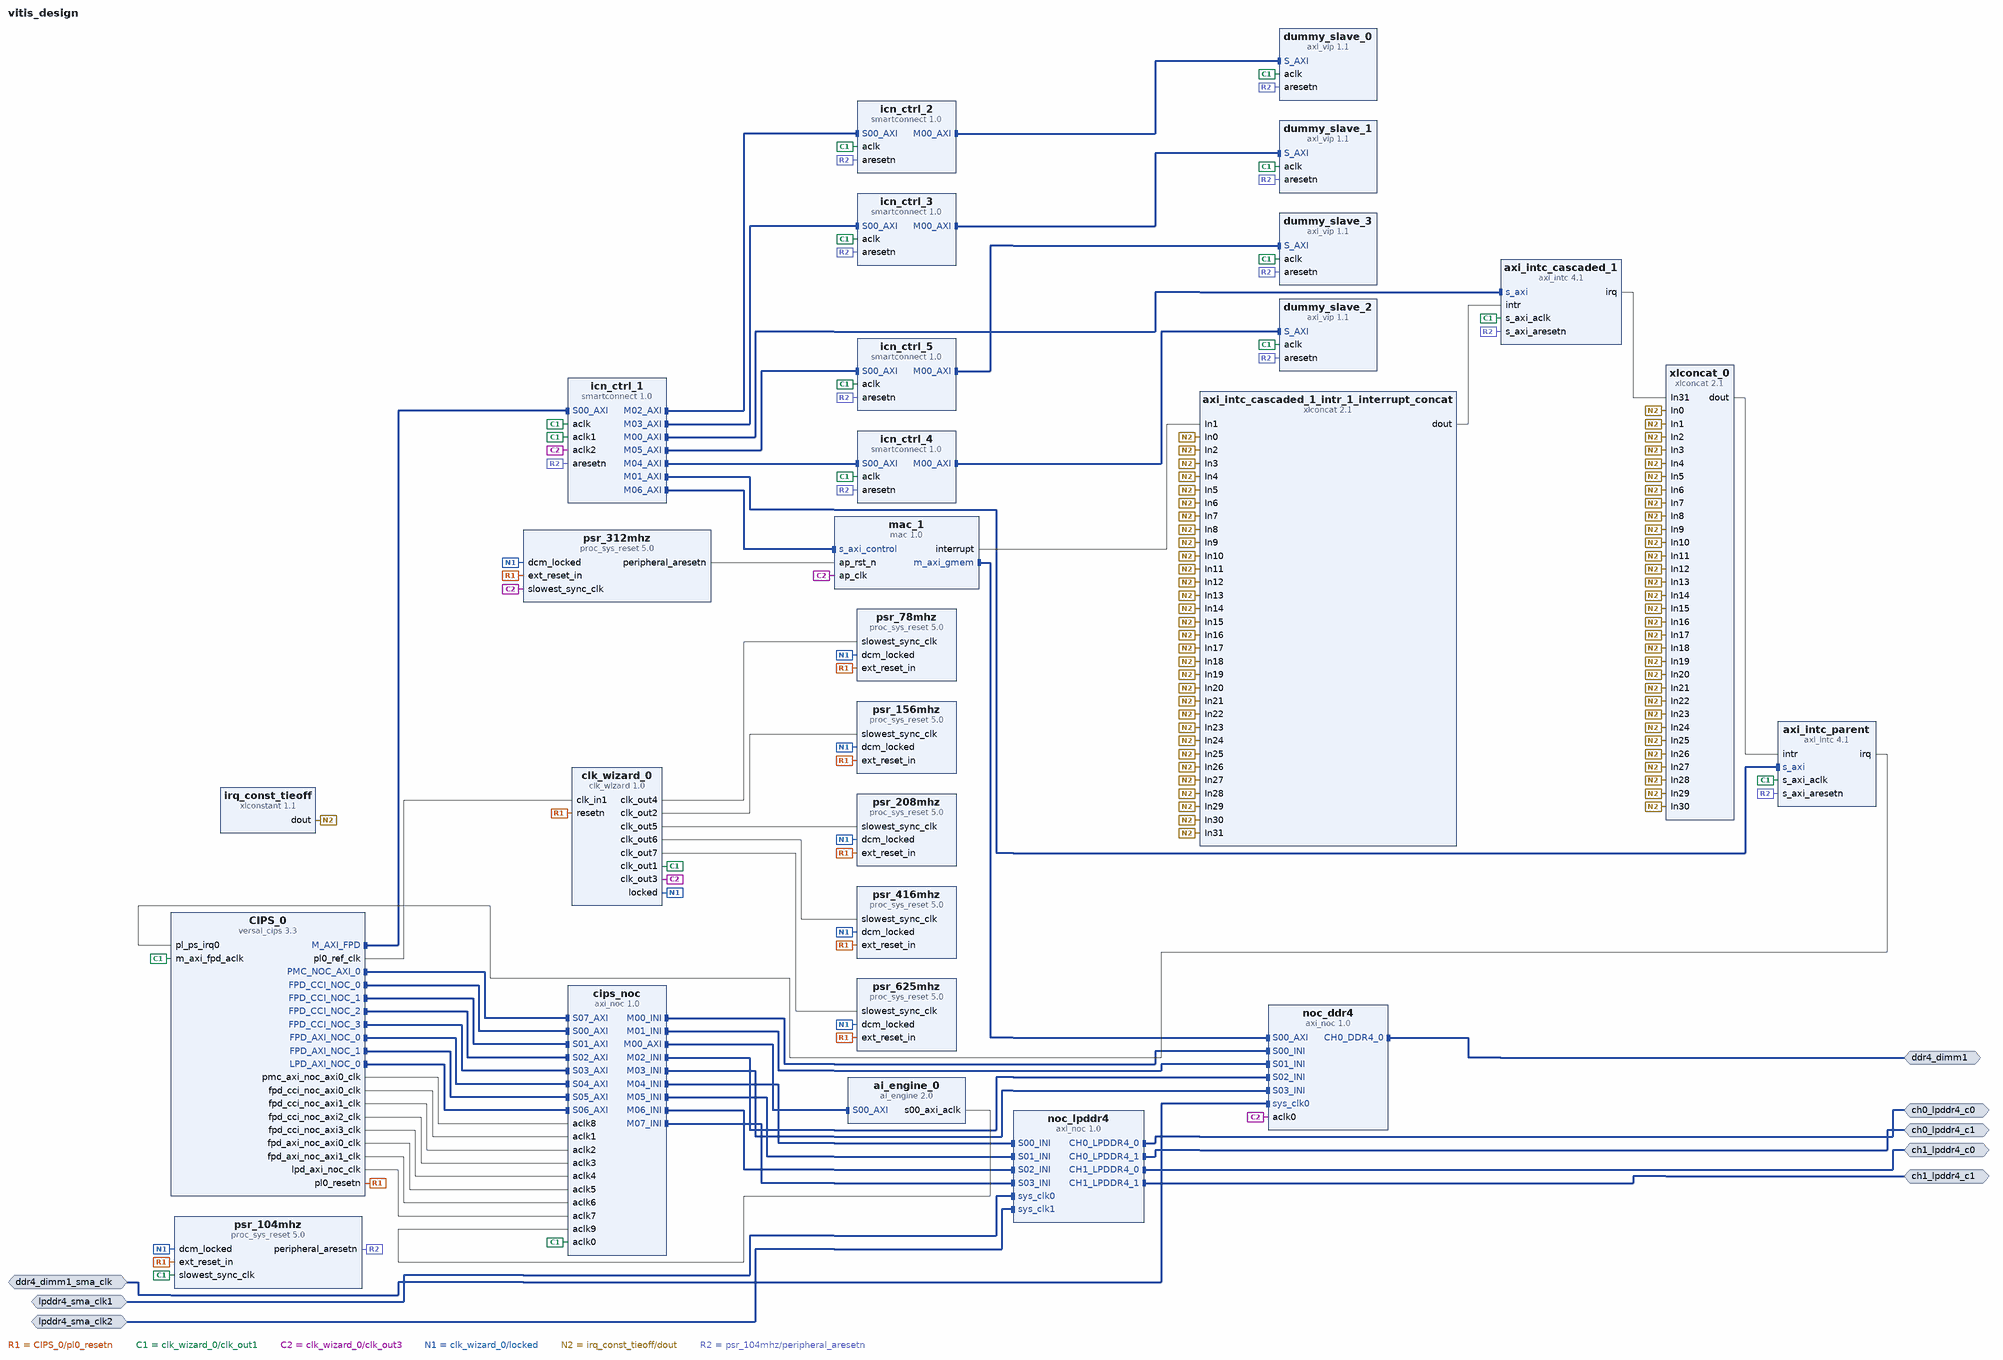
[diagram p0: block diagram of the top level]
# Vivado block design vitis_design, xcvc1902-vsva2197-2MP-e-S, Vivado 2023.1
create_bd_design vitis_design

create_bd_intf_port -mode Master -vlnv xilinx.com:interface:ddr4_rtl:1.0 ddr4_dimm1
create_bd_intf_port -mode Slave -vlnv xilinx.com:interface:diff_clock_rtl:1.0 ddr4_dimm1_sma_clk
set_property -dict {CONFIG.FREQ_HZ 200000000} [get_bd_intf_ports ddr4_dimm1_sma_clk]
create_bd_intf_port -mode Master -vlnv xilinx.com:interface:lpddr4_rtl:1.0 ch0_lpddr4_c0
create_bd_intf_port -mode Master -vlnv xilinx.com:interface:lpddr4_rtl:1.0 ch0_lpddr4_c1
create_bd_intf_port -mode Master -vlnv xilinx.com:interface:lpddr4_rtl:1.0 ch1_lpddr4_c0
create_bd_intf_port -mode Master -vlnv xilinx.com:interface:lpddr4_rtl:1.0 ch1_lpddr4_c1
create_bd_intf_port -mode Slave -vlnv xilinx.com:interface:diff_clock_rtl:1.0 lpddr4_sma_clk1
set_property -dict {CONFIG.FREQ_HZ 200000000} [get_bd_intf_ports lpddr4_sma_clk1]
create_bd_intf_port -mode Slave -vlnv xilinx.com:interface:diff_clock_rtl:1.0 lpddr4_sma_clk2
set_property -dict {CONFIG.FREQ_HZ 200000000} [get_bd_intf_ports lpddr4_sma_clk2]

create_bd_cell -type ip -vlnv xilinx.com:ip:versal_cips:3.3 CIPS_0
